# Altium project PRJ_MCP_41x_453x.PrjPCB
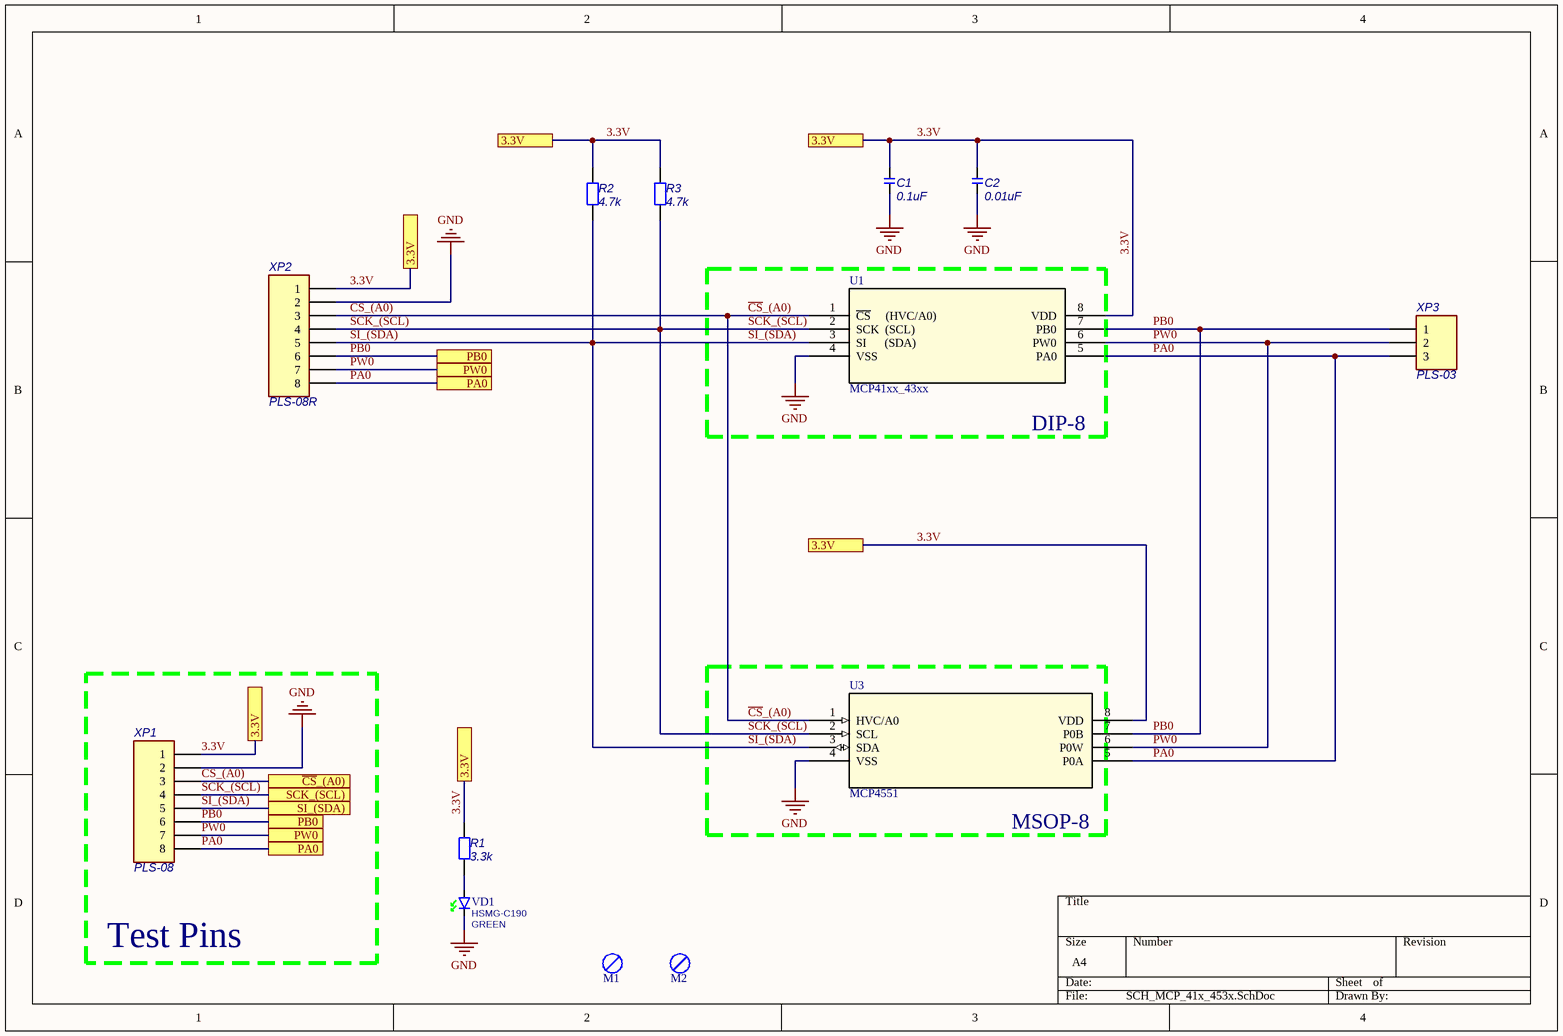
[diagram p0: SCH_MCP_41x_453x.SchDoc]
1 sheet, 13 parts. Net scope: flat (ports and power ports of the same name join across sheets).
Board file: PCB_MCP_41x_453x.PcbDoc

## Sheet SCH_MCP_41x_453x.SchDoc
size A4

### Parts
C1  0.1uF  [SMD0603-v3]
C2  0.01uF  [SMD0603-v3]
M1  Mehanical_Pin  [Mehanical_Pin]  (value not drawn)
M2  Mehanical_Pin  [Mehanical_Pin]  (value not drawn)
R1  3.3k  [SMD0603-v1]
R2  4.7k  [SMD0603-v1]
R3  4.7k  [SMD0603-v1]
U1  MCP41xx_43xx  [DIP-8_3D]
U3  MCP4551  [SOP65P490X109-8N]
VD1  Manufacturer Part No.: HSMG-C190  Color: GREEN  [LEDC1608X80N_G]  (hidden comment: LED)
XP1  PLS-08  [PLS-08]
XP2  PLS-08R  [PLS-08R-LEFT]
XP3  PLS-03  [PLS-03]

### Blocks framed on the sheet
DIP-8: U1
Test Pins: XP1
MSOP-8: U3

### Ports
3.3V, PA0, PB0, PW0, SCK_(SCL), SI_(SDA), ~{CS}_(A0)

### Nets
GND: C1.1 C2.1 U1.4(VSS) U3.4(VSS) VD1.1(K) XP1.2 XP2.2
3.3V: C1.2 C2.2 R1.2 R2.2 R3.2 U1.8(VDD) U3.8(VDD) XP1.1 XP2.1 ; port 3.3V
~{CS}_(A0): U1.1(~{CS}_____(HVC/A0)) U3.1(HVC/A0) XP1.3 XP2.3 ; port ~{CS}_(A0)
PA0: U1.5(PA0) U3.5(P0A) XP1.8 XP2.8 XP3.3 ; port PA0
PB0: U1.7(PB0) U3.7(P0B) XP1.6 XP2.6 XP3.1 ; port PB0
PW0: U1.6(PW0) U3.6(P0W) XP1.7 XP2.7 XP3.2 ; port PW0
SCK_(SCL): R3.1 U1.2(SCK__(SCL)) U3.2(SCL) XP1.4 XP2.4 ; port SCK_(SCL)
SI_(SDA): R2.1 U1.3(SI______(SDA)) U3.3(SDA) XP1.5 XP2.5 ; port SI_(SDA)
NetR1_1: R1.1 VD1.2(A)

Not connected (* = marked no-connect by the designer): M1 M; M2 M

### Library data of the parts
C1 = SMD0603-0.1uF-50V: Конденсатор неполярный; Manufacturer: Rohm Semiconductor; Tolerance: ±10%; Power\Voltage: 50В; Ведомость покупных: Y; Author: Sun; Part Number: SMD0603-0.1uF-50V; DateModification: 28.03.2015; ManufacturerPartNumber: *; Value: 0.1uF; TKE: *; Корпус: SMD0603; TU/GOST: *; Примечание: *; Rem: *; SpecificationName: Конденсатор; ComponentLink1Description: Параметры; Component Type: Standard; Component Kind: Standard
C2 = SMD0603-0.01uF-50V: Конденсатор неполярный; Power\Voltage: 50В; Ведомость покупных: Y; Author: Sun; Part Number: SMD0603-0.01uF-50V; DateModification: 09.10.2016; ManufacturerPartNumber: *; Value: 0.01uF; Tolerance: *; TKE: *; Корпус: SMD0603; TU/GOST: *; Примечание: *; Rem: *; SpecificationName: Конденсатор; ComponentLink1Description: Параметры; Component Type: Standard; Component Kind: Standard
R1 = SMD0603-3.3k-1%: Резистор постоянный; Manufacturer: Rohm Semiconductor; Tolerance: 1%; Ведомость покупных: Y; Author: Sun; Part Number: SMD0603-3.3k-1%; DateModication: 12.10.2016; ManufacturerPartNumber: *; Value: 3.3k; Power\Voltage: *; TKE: *; Корпус: SMD0603; TU/GOST: *; Примечание: *; Rem: *; SpecificationName: Резистор; ComponentLink1Description: Параметры; ComponentLink1URL: *; ComponentLink2Description: Сайт производителя; ComponentLink2URL: http://www.royalohm.com/; Component Type: Standard; Component Kind: Standard
R2 R3 = SMD0603-4.7k-1%: Резистор постоянный; Manufacturer: Rohm Semiconductor; Tolerance: 1%; Ведомость покупных: Y; Author: Sun; Part Number: SMD0603-4.7k-1%; DateModication: 12.10.2016; ManufacturerPartNumber: *; Value: 4.7k; Power\Voltage: *; TKE: *; Корпус: SMD0603; TU/GOST: *; Примечание: *; Rem: *; SpecificationName: Резистор; ComponentLink1Description: Параметры; ComponentLink1URL: *; ComponentLink2Description: Сайт производителя; ComponentLink2URL: http://www.royalohm.com/; Component Type: Standard; Component Kind: Standard
U1 = MCP41xx_43xx: Digital Potentiometer with SPI or I2C Interface; Mfr_Name: Microchip; Manufacturer_Part_Number: MCP41010T-E/SN; Корпус: SOIC-8; SpecificationName: IC; Copyright: Copyright (C) 2021 Ultra Librarian. All rights reserved.; RefDes: RefDes; Type: DEV; Part Number: MCP41xx_43xx; DateModification: 08.10.2021; Manufacturer: Microchip; ManufacturerPartNumber: MCP41xx_43xx; Value: *; Tolerance: *; Power\Voltage: *; TKE: *; TU/GOST: *; Примечание: *; Rem: *
U3 = MCP4551: Digital Potentiometer with I2C Interface, 257 steps, Memory type: RAM; Mfr_Name: Microchip; Manufacturer_Part_Number: MCP4531-103E/MS; Корпус: MSOP-8; SpecificationName: IC; Copyright: Copyright (C) 2021 Ultra Librarian. All rights reserved.; RefDes: RefDes; Type: DEV; Part Number: MCP4551; DateModification: 08.10.2021; Manufacturer: Microchip; ManufacturerPartNumber: MCP4551; Value: *; Tolerance: *; Power\Voltage: *; TKE: *; TU/GOST: *; Примечание: *; Rem: *
VD1 = LED-Avago-HSMG-C190_Green: Surface mount LED green 20mA; Manufacturer Name: Avago; Part Number: LED-Avago-HSMG-C190_Green; ManufacturerPartNumber: LED-Avago-HSMG-C190_Green
XP1 = PLS-08: Однорядный прямой штыревой соединитель; Manufacturer: BrownBear; SpecificationName: Connector; Ведомость покупных: Y; Author: Gr.; Part Number: PLS-08; DateModification: 24.03.2011; ManufacturerPartNumber: PLS-08; Value: *; Tolerance: *; Power\Voltage: *; TKE: *; Корпус: *; TU/GOST: *; Примечание: *; Rem: *; ComponentLink1Description: Parametrs; ComponentLink2Description: Site; ComponentLink2URL: http://www.brownbear.ru/; Component Type: Standard; Component Kind: Standard
XP2 = PLS-08R: Однорядный угловой штыревой соединитель; Manufacturer: BrownBear; SpecificationName: Connector; Ведомость покупных: Y; Author: Gr.; Part Number: PLS-08R; DateModification: 24.03.2011; ManufacturerPartNumber: PLS-08R; Value: *; Tolerance: *; Power\Voltage: *; TKE: *; Корпус: *; TU/GOST: *; Примечание: *; Rem: *; ComponentLink1Description: Parametrs; ComponentLink2Description: Site; ComponentLink2URL: http://www.brownbear.ru/; Component Type: Standard; Component Kind: Standard
XP3 = PLS-03: Однорядный прямой штыревой соединитель; Manufacturer: BrownBear; SpecificationName: Connector; Ведомость покупных: Y; Author: Gr.; Part Number: PLS-03; DateModification: 24.03.2011; ManufacturerPartNumber: PLS-03; Value: *; Tolerance: *; Power\Voltage: *; TKE: *; Корпус: *; TU/GOST: *; Примечание: *; Rem: *; ComponentLink1Description: Parametrs; ComponentLink2Description: Site; ComponentLink2URL: http://www.brownbear.ru/; Component Type: Standard; Component Kind: Standard
M1 M2 = Mehanical_PIN: Part Number: Mehanical_PIN